# EAGLE schematic curmirror (EAGLE 9.2.0)
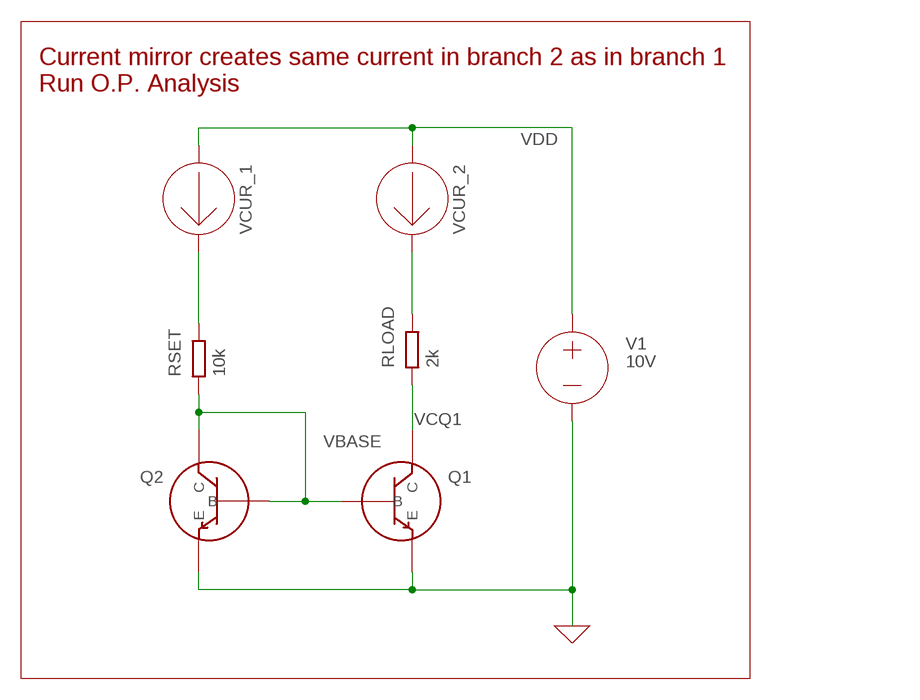
[diagram p0: schematic, sheet 1]

## Parts
Q1  BJT_NPN  (no package)
Q2  BJT_NPN  (no package)
RLOAD  2k  R  (no package)
RSET  10k  R  (no package)
V1  10V  VOLTAGE  (no package)
VCUR_1  0V  AMMETER  (no package)
VCUR_2  0V  AMMETER  (no package)

## Nets
0: Q1.E Q2.E V1.- ; supply symbol labelled GND
N$2: RSET.2 VCUR_1.-
N$4: RLOAD.2 VCUR_2.-
VBASE: Q1.B Q2.B Q2.C RSET.1
VCQ1: Q1.C RLOAD.1
VDD: V1.+ VCUR_1.+ VCUR_2.+

## Notes on the sheet
- Current mirror creates same current in branch 2 as in branch 1
  Run O.P. Analysis

## Library data of the parts
Q1 Q2 = ngspice-simulation:BJT_NPN: Bipolar NPN Transistor
RLOAD RSET = ngspice-simulation:R: RESISTOR
V1 = ngspice-simulation:VOLTAGE: Independent Voltage Source, either DC, AC, PULSE, SINE, PWL, EXP, or SFFM; VALUE: 0V
VCUR_1 VCUR_2 = ngspice-simulation:AMMETER: AMMETER